# Altium project Teclado numerico.PrjPcb
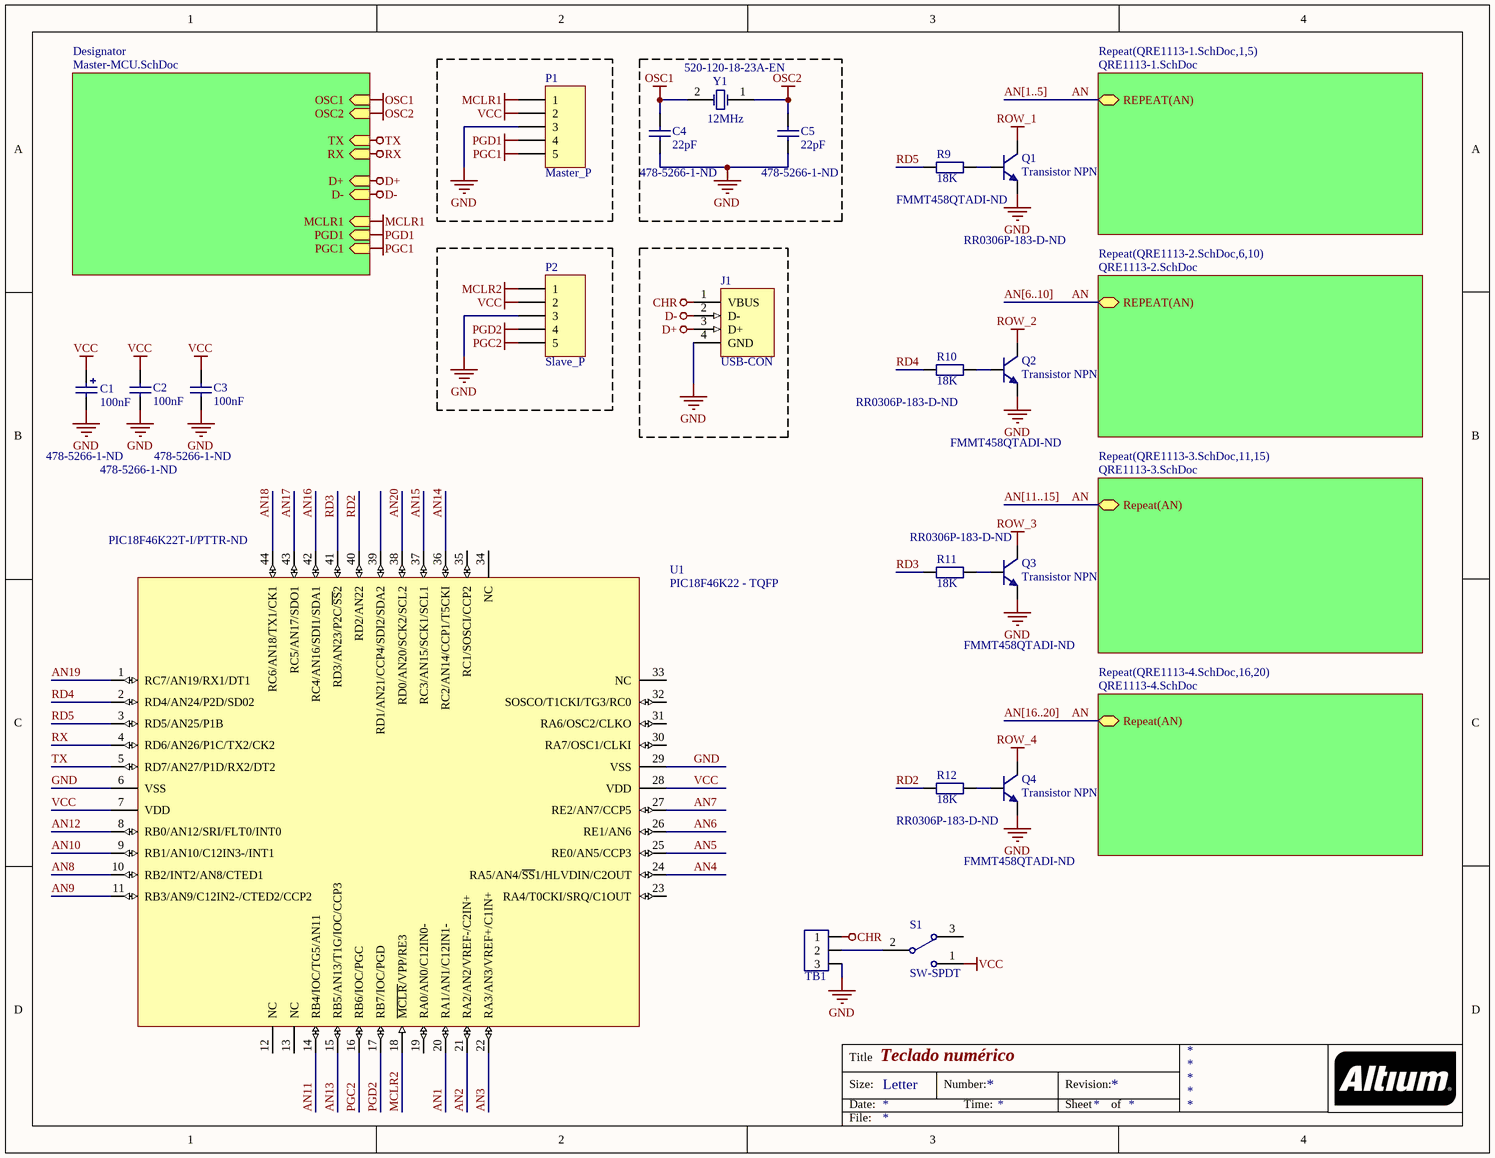
[diagram p0: Teclado numerico.SchDoc]
6 sheets, 108 parts. Net scope: hierarchical (ports join the sheet entries above them; power ports are global).
Board file: Teclado numerico.PcbDoc
Sheets:
  Teclado numerico.SchDoc
    Designator = Master-MCU.SchDoc
    QRE1113-1.SchDoc1 = QRE1113-1.SchDoc
    QRE1113-1.SchDoc2 = QRE1113-1.SchDoc
    QRE1113-1.SchDoc3 = QRE1113-1.SchDoc
    QRE1113-1.SchDoc4 = QRE1113-1.SchDoc
    QRE1113-1.SchDoc5 = QRE1113-1.SchDoc
    QRE1113-2.SchDoc6 = QRE1113-2.SchDoc
    QRE1113-2.SchDoc7 = QRE1113-2.SchDoc
    QRE1113-2.SchDoc8 = QRE1113-2.SchDoc
    QRE1113-2.SchDoc9 = QRE1113-2.SchDoc
    QRE1113-2.SchDoc10 = QRE1113-2.SchDoc
    QRE1113-3.SchDoc11 = QRE1113-3.SchDoc
    QRE1113-3.SchDoc12 = QRE1113-3.SchDoc
    QRE1113-3.SchDoc13 = QRE1113-3.SchDoc
    QRE1113-3.SchDoc14 = QRE1113-3.SchDoc
    QRE1113-3.SchDoc15 = QRE1113-3.SchDoc
    QRE1113-4.SchDoc16 = QRE1113-4.SchDoc
    QRE1113-4.SchDoc17 = QRE1113-4.SchDoc
    QRE1113-4.SchDoc18 = QRE1113-4.SchDoc
    QRE1113-4.SchDoc19 = QRE1113-4.SchDoc
    QRE1113-4.SchDoc20 = QRE1113-4.SchDoc

## Sheet Teclado numerico.SchDoc: Teclado numérico
size Letter

### Parts
C1  100nF  Supplier Part Number 1: 478-5266-1-ND  [C-0603]
C2  100nF  Supplier Part Number 1: 478-5266-1-ND  [C-0603]
C3  100nF  Supplier Part Number 1: 478-5266-1-ND  [C-0603]
C4  22pF  Supplier Part Number 1: 478-5266-1-ND  [C-0603]
C5  22pF  Supplier Part Number 1: 478-5266-1-ND  [C-0603]
J1  USB-CON  [USB-A]
P1  Master_P  [HDR1X5]
P2  Slave_P  [HDR1X5]
Q1  Transistor NPN  Supplier Part Number 1: FMMT458QTADI-ND  [SOT95P237X111-3M-JV]
Q2  Transistor NPN  Supplier Part Number 1: FMMT458QTADI-ND  [SOT95P237X111-3M-JV]
Q3  Transistor NPN  Supplier Part Number 1: FMMT458QTADI-ND  [SOT95P237X111-3M-JV]
Q4  Transistor NPN  Supplier Part Number 1: FMMT458QTADI-ND  [SOT95P237X111-3M-JV]
R9  18K  Supplier Part Number 1: RR0306P-183-D-ND  [R-0603]
R10  18K  Supplier Part Number 1: RR0306P-183-D-ND  [R-0603]
R11  18K  Supplier Part Number 1: RR0306P-183-D-ND  [R-0603]
R12  18K  Supplier Part Number 1: RR0306P-183-D-ND  [R-0603]
S1  SW-SPDT  [SPDT]
TB1  Terminal Block 3  [SPDT]  (value not drawn)
U1  PIC18F46K22 - TQFP  Supplier Part Number 3: PIC18F46K22T-I/PTTR-ND  [TQFP-44_JV]
Y1  12MHz  Supplier Part Number 1: 520-120-18-23A-EN  [ECX64A-jv]

### Sub-sheets
Designator = Master-MCU.SchDoc: OSC1 (in), OSC2 (in), TX (in), RX (in), D+ (in), D- (in), MCLR1 (in), PGD1 (in), PGC1 (in)
Repeat(QRE1113-1.SchDoc,1,5) = QRE1113-1.SchDoc: REPEAT(AN)
Repeat(QRE1113-2.SchDoc,6,10) = QRE1113-2.SchDoc: REPEAT(AN)
Repeat(QRE1113-3.SchDoc,11,15) = QRE1113-3.SchDoc: Repeat(AN)
Repeat(QRE1113-4.SchDoc,16,20) = QRE1113-4.SchDoc: Repeat(AN)

### Nets
CHR: J1.1(VBUS) TB1.1
D+: J1.3(D+) ; sheet Designator/D+
D-: J1.2(D-) ; sheet Designator/D-
GND: C1.2 C2.1 C3.1 C4.2 C5.2 J1.4(GND) P1.3 P2.3 Q1.1(E) Q2.1(E) Q3.1(E) Q4.1(E) TB1.3 U1.6(VSS) U1.29(VSS)
MCLR1: P1.1 ; sheet Designator/MCLR1
MCLR2: P2.1 U1.18(~{MCLR}/VPP/RE3)
OSC1: C4.1 Y1.2(OSC2) ; sheet Designator/OSC1
OSC2: C5.1 Y1.1(OSC1) ; sheet Designator/OSC2
PGC1: P1.5 ; sheet Designator/PGC1
PGC2: P2.5 U1.16(RB6/IOC/PGC)
PGD1: P1.4 ; sheet Designator/PGD1
PGD2: P2.4 U1.17(RB7/IOC/PGD)
ROW_1: Q1.3(C)
ROW_2: Q2.3(C)
ROW_3: Q3.3(C)
ROW_4: Q4.3(C)
RX: U1.4(RD6/AN26/P1C/TX2/CK2) ; sheet Designator/RX
TX: U1.5(RD7/AN27/P1D/RX2/DT2) ; sheet Designator/TX
VCC: C1.1 C2.2 C3.2 P1.2 P2.2 S1.1 U1.7(VDD) U1.28(VDD)
AN: sheet Repeat(QRE1113-1.SchDoc,1,5)/REPEAT(AN), sheet Repeat(QRE1113-2.SchDoc,6,10)/REPEAT(AN), sheet Repeat(QRE1113-3.SchDoc,11,15)/Repeat(AN), sheet Repeat(QRE1113-4.SchDoc,16,20)/Repeat(AN)
AN1: U1.20(RA1/AN1/C12IN1-)  [project net AN]
AN2: U1.21(RA2/AN2/VREF-/C2IN+)  [project net AN]
AN3: U1.22(RA3/AN3/VREF+/C1IN+)  [project net AN]
AN4: U1.24(RA5/AN4/~{SS}1/HLVDIN/C2OUT)  [project net AN]
AN5: U1.25(RE0/AN5/CCP3)  [project net AN]
AN6: U1.26(RE1/AN6)  [project net AN]
AN7: U1.27(RE2/AN7/CCP5)  [project net AN]
AN8: U1.10(RB2/INT2/AN8/CTED1)  [project net AN]
AN9: U1.11(RB3/AN9/C12IN2-/CTED2/CCP2)  [project net AN]
AN10: U1.9(RB1/AN10/C12IN3-/INT1)  [project net AN]
AN11: U1.14(RB4/IOC/TG5/AN11)  [project net AN]
AN12: U1.8(RB0/AN12/SRI/FLT0/INT0)  [project net AN]
AN13: U1.15(RB5/AN13/T1G/IOC/CCP3)  [project net AN]
AN14: U1.36(RC2/AN14/CCP1/T5CKI)  [project net AN]
AN15: U1.37(RC3/AN15/SCK1/SCL1)  [project net AN]
AN16: U1.42(RC4/AN16/SDI1/SDA1)  [project net AN]
AN17: U1.43(RC5/AN17/SDO1)  [project net AN]
AN18: U1.44(RC6/AN18/TX1/CK1)  [project net AN]
AN19: U1.1(RC7/AN19/RX1/DT1)  [project net AN]
AN20: U1.38(RD0/AN20/SCK2/SCL2)  [project net AN]
RD2: R12.1 U1.40(RD2/AN22)
RD3: R11.1 U1.41(RD3/AN23/P2C/~{SS}2)
RD4: R10.1 U1.2(RD4/AN24/P2D/SD02)
RD5: R9.1 U1.3(RD5/AN25/P1B)
NetQ1_2: Q1.2(B) R9.2
NetQ2_2: Q2.2(B) R10.2
NetQ3_2: Q3.2(B) R11.2
NetQ4_2: Q4.2(B) R12.2
NetS1_2: S1.2 TB1.2

Not connected (* = marked no-connect by the designer): S1 3; U1 12(NC) 13(NC) 19(RA0/AN0/C12IN0-) 23(RA4/T0CKI/SRQ/C1OUT) 30(RA7/OSC1/CLKI) 31(RA6/OSC2/CLKO) 32(SOSCO/T1CKI/TG3/RC0) 33(NC) 34(NC) 35(RC1/SOSCI/CCP2) 39(RD1/AN21/CCP4/SDI2/SDA2)

### Buses and harness runs
bus AN[1..5]
bus AN[6..10]
bus AN[11..15]
bus AN[16..20]

### Notes on the sheet
- Title
- Size:
- Date:
- Letter
- Number:
- Time:
- Revision:
- Sheet
- of
- File:

### Library data of the parts
C1 = Electrolytic Capacitor: Value: 100uF; Supplier 1: Digi-Key
C2-C5 = Capacitor 1: Capacitor; Value: 100pF; Supplier 1: Digi-Key
J1 = USB-CON: USB 1.1, Right Angle, SMT, A Type, Receptacle, 4 Position, White; ContactMaterial: Copper Alloy; ContactPlating: Gold over Palladium Nickel; PCB_Layout: Complies with manufacturer's recommendation.; DrillSize: Corresponds to nominal value.; PanelGround: Without; Published: 15-Jul-2004; DatasheetDocument: 11-Apr-2003; PackageDocument: 11-Apr-2003; PackageReference: 353576; Publisher: Altium Limited; HousingMaterial: Thermoplastic; ComponentLink1Description: Manufacturer Link; ComponentLink1URL: http://www.tycoelectronics.com/; ComponentLink2Description: Packaging Specification; ComponentLink2URL: http://ecommas.tycoelectronics.com/commerce/DocumentDelivery/DDEController?Action=showdoc&DocId=Customer+Drawing%7F353576%7FD%7Ftif%7FJapanese%7FJPN_CD_353576_D.tif
P1 P2 = Header 5: Header, 5-Pin; LatestRevisionDate: 17-Jul-2002; LatestRevisionNote: Re-released for DXP Platform.; Publisher: Altium Limited
Q1-Q4 = Transistor NPN: NPN General Purpose Amplifier; Published: 8-Jun-2000; LatestRevisionDate: 15-Jan-2003; LatestRevisionNote: PCB Footprint 'BCY-W3/D4.7' replaced; DatasheetVersion: 1997; PackageVersion: Sep-1998; PackageReference: TO-92A; Publisher: Altium Limited; Code_JEDEC: TO-92A; ComponentLink1Description: Manufacturer Link; ComponentLink1URL: http://www.fairchildsemi.com/; ComponentLink2Description: Datasheet; ComponentLink2URL: http://www.fairchildsemi.com/ds/2N%2F2N3904.pdf; Supplier 1: Digi-Key
R9-R12 = Resistor 1: Resistor; Value: 1K; Supplier 1: Digi-Key
S1 = SW-SPDT: SPDT Subminiature Toggle Switch, Right Angle Mounting, Vertical Actuation; Published: 24-Mar-1999; LatestRevisionDate: 17-Dec-2003; LatestRevisionNote: Schematic revised, PCB Footprint replaced.; DatasheetVersion: 05-Dec-2000; PackageReference: TL36WW15050; Publisher: Altium Limited; ComponentLink1Description: Manufacturer Link; ComponentLink1URL: http://www.apem.com
TB1 = Terminal Block 3: Terminal Block, 3 pins
U1 = PIC18F46K22 - TQFP: Flash Microcontroller with 10-Bit A/D and nanoWatt Technology, 32K Flash, 44-Pin QFN, Extended Temperature Range; Published: 2-Dec-2009; DatasheetVersion: revF, Sep-2009; PackageVersion: revBB, Aug-2009; PackageReference: QFN-ML44; Publisher: Altium Limited; PackageDescription: 44-Lead Plastic Quad Flat, No Lead Package (ML) - 8x8 mm Body [QFN]; Supplier 1: Digi-Key; Supplier Part Number 1: PIC18F46K20-E/ML-ND; Supplier 2: Farnell; Supplier Part Number 2: 1664863; Code_JEDEC: MO-220; Code_IPC: QFN65P800X800-44V2; ComponentLink1Description: Datasheet; ComponentLink1URL: http://ww1.microchip.com/downloads/en/DeviceDoc/41303F.pdf; ComponentLink2Description: Packaging Specification; ComponentLink2URL: http://www.microchip.com/stellent/groups/techpub_sg/documents/packagingspec/en012702.pdf; ComponentLink3Description: Microchip.com Home; ComponentLink3URL: http://www.microchip.com/; Supplier 3: Digi-Key
Y1 = XTAL: Crystal Oscillator; Published: 8-Jun-2000; LatestRevisionDate: 17-Jul-2002; LatestRevisionNote: Re-released for DXP Platform.; PackageReference: R38; Publisher: Altium Limited; Supplier 1: Mouser

## Sheet Master-MCU.SchDoc
size A
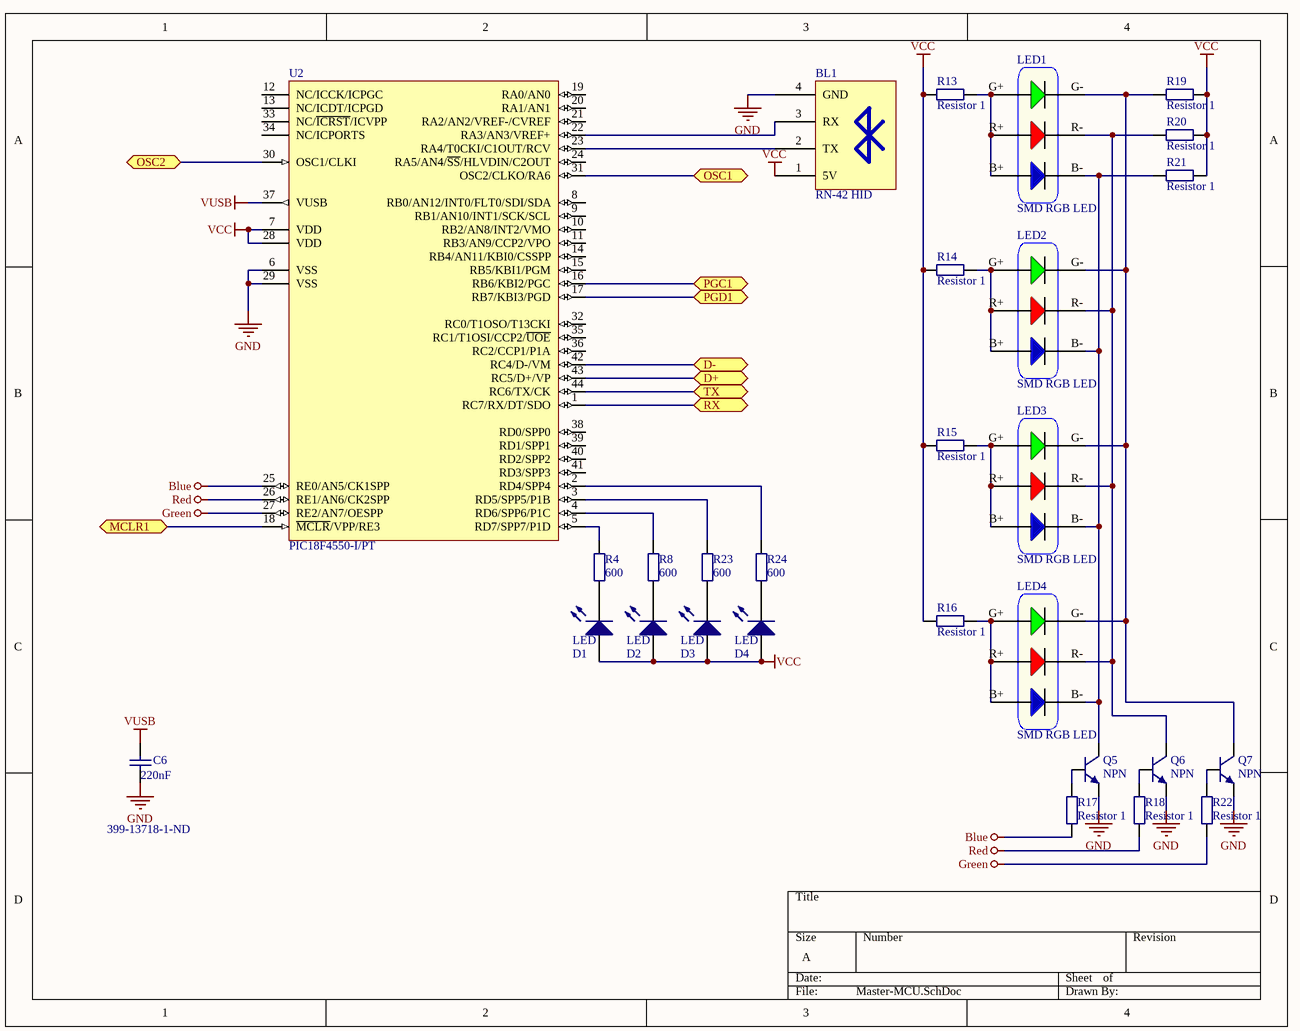
[diagram p1: Master-MCU.SchDoc]

### Parts
BL1  RN-42 HID  [Bluetooth module for PCB mounting]
C6  220nF  Supplier Part Number 1: 399-13718-1-ND  [C-0603]
D1  LED  [LED-SMD-R]
D2  LED  [LED-SMD-R]
D3  LED  [LED-SMD-R]
D4  LED  [LED-SMD-R]
LED1  SMD RGB LED  [SMD LED]
LED2  SMD RGB LED  [SMD LED]
LED3  SMD RGB LED  [SMD LED]
LED4  SMD RGB LED  [SMD LED]
Q5  NPN  [SOT95P237X111-3M-JV]
Q6  NPN  [SOT95P237X111-3M-JV]
Q7  NPN  [SOT95P237X111-3M-JV]
R4  600  [R-0603-3D]
R8  600  [R-0603-3D]
R13  Resistor 1  [R-0603-3D]
R14  Resistor 1  [R-0603-3D]
R15  Resistor 1  [R-0603-3D]
R16  Resistor 1  [R-0603-3D]
R17  Resistor 1  [R-0603-3D]
R18  Resistor 1  [R-0603-3D]
R19  Resistor 1  [R-0603-3D]
R20  Resistor 1  [R-0603-3D]
R21  Resistor 1  [R-0603-3D]
R22  Resistor 1  [R-0603-3D]
R23  600  [R-0603-3D]
R24  600  [R-0603-3D]
U2  PIC18F4550-I/PT  [TQFP-44_JV]

### Ports
D+, D-, MCLR1, OSC1, OSC2, PGC1, PGD1, RX, TX

### Nets
Blue: R17.1 U2.25(RE0/AN5/CK1SPP)
D+: U2.43(RC5/D+/VP) ; port D+
D-: U2.42(RC4/D-/VM) ; port D-
GND: BL1.4(GND) C6.1 Q5.1(E) Q6.1(E) Q7.1(E) U2.6(VSS) U2.29(VSS)
Green: R22.1 U2.27(RE2/AN7/OESPP)
MCLR1: U2.18(~{MCLR}/VPP/RE3) ; port MCLR1
OSC1: U2.31(OSC2/CLKO/RA6) ; port OSC1
OSC2: U2.30(OSC1/CLKI) ; port OSC2
PGC1: U2.16(RB6/KBI2/PGC) ; port PGC1
PGD1: U2.17(RB7/KBI3/PGD) ; port PGD1
Red: R18.1 U2.26(RE1/AN6/CK2SPP)
RX: U2.1(RC7/RX/DT/SDO) ; port RX
TX: U2.44(RC6/TX/CK) ; port TX
VCC: BL1.1(5V) D1.1(A) D2.1(A) D3.1(A) D4.1(A) R13.1 R14.1 R15.1 R16.1 R19.1 R20.1 R21.1 U2.7(VDD) U2.28(VDD)
VUSB: C6.2 U2.37(VUSB)
NetBL1_2: BL1.2(TX) U2.23(RA4/T0CKI/C1OUT/RCV)
NetBL1_3: BL1.3(RX) U2.22(RA3/AN3/VREF+)
NetD1_2: D1.2(K) R4.2
NetD2_2: D2.2(K) R8.2
NetD3_2: D3.2(K) R23.2
NetD4_2: D4.2(K) R24.2
NetLED1_B+: LED1.B+ LED1.G+ LED1.R+ R13.2
NetLED1_B-: LED1.B- LED2.B- LED3.B- LED4.B- Q5.3(C) R21.2
NetLED1_G-: LED1.G- LED2.G- LED3.G- LED4.G- Q7.3(C) R19.2
NetLED1_R-: LED1.R- LED2.R- LED3.R- LED4.R- Q6.3(C) R20.2
NetLED2_B+: LED2.B+ LED2.G+ LED2.R+ R14.2
NetLED3_B+: LED3.B+ LED3.G+ LED3.R+ R15.2
NetLED4_B+: LED4.B+ LED4.G+ LED4.R+ R16.2
NetQ5_2: Q5.2(B) R17.2
NetQ6_2: Q6.2(B) R18.2
NetQ7_2: Q7.2(B) R22.2
NetR4_1: R4.1 U2.5(RD7/SPP7/P1D)
NetR8_1: R8.1 U2.4(RD6/SPP6/P1C)
NetR23_1: R23.1 U2.3(RD5/SPP5/P1B)
NetR24_1: R24.1 U2.2(RD4/SPP4)

Not connected (* = marked no-connect by the designer): U2 8(RB0/AN12/INT0/FLT0/SDI/SDA) 9(RB1/AN10/INT1/SCK/SCL) 10(RB2/AN8/INT2/VMO) 11(RB3/AN9/CCP2/VPO) 12(NC/ICCK/ICPGC) 13(NC/ICDT/ICPGD) 14(RB4/AN11/KBI0/CSSPP) 15(RB5/KBI1/PGM) 19(RA0/AN0) 20(RA1/AN1) 21(RA2/AN2/VREF-/CVREF) 24(RA5/AN4/~{SS}/HLVDIN/C2OUT) 32(RC0/T1OSO/T13CKI) 33(NC/~{ICRST}/ICVPP) 34(NC/ICPORTS) 35(RC1/T1OSI/CCP2/~{UOE}) 36(RC2/CCP1/P1A) 38(RD0/SPP0) 39(RD1/SPP1) 40(RD2/SPP2) 41(RD3/SPP3)

### Library data of the parts
BL1 = Bluetooth module for PCB mounting
C6 = Capacitor 1: Capacitor; Value: 100pF; Supplier 1: Digi-Key
D1-D4 = LED: Typical LED; Published: 8-Jun-2000; LatestRevisionDate: 17-Jul-2002; LatestRevisionNote: Re-released for DXP Platform.; PackageVersion: Feb-2002; PackageReference: 3.2X1.6X1.1; Publisher: Altium Limited
LED1-LED4 = LED: https://www.tweaking4all.com/wp-content/uploads/2014/01/5050LED.pdf
Q5-Q7 = Transistor NPN: NPN General Purpose Amplifier; Published: 8-Jun-2000; LatestRevisionDate: 15-Jan-2003; LatestRevisionNote: PCB Footprint 'BCY-W3/D4.7' replaced; DatasheetVersion: 1997; PackageVersion: Sep-1998; PackageReference: TO-92A; Publisher: Altium Limited; Code_JEDEC: TO-92A; ComponentLink1Description: Manufacturer Link; ComponentLink1URL: http://www.fairchildsemi.com/; ComponentLink2Description: Datasheet; ComponentLink2URL: http://www.fairchildsemi.com/ds/2N%2F2N3904.pdf
R4 R8 R13-R24 = Resistor 1: Resistor; Value: 1K
U2 = PIC18F4550-I/PT: High Performance, Enhanced Flash, USB Microcontroller with nanoWatt Technology, 32K Flash, 44-Pin TQFP, Industrial Temperature Range; Published: 29-Jan-2009; LatestRevisionDate: 02-Dec-2009; LatestRevisionNote: Updated to datasheet revision E, Aug-2008; DatasheetVersion: revE, Aug-2008; PackageVersion: revBB, Aug-2009; PackageReference: TQFP-PT44; Publisher: Altium Limited; PackageDescription: 44-Lead Plastic Thin Quad Flatpack (PT) - 10x10x1mm Body, 2.00mm [TQFP]; Supplier 1: Digi-Key; Supplier Part Number 1: PIC18F4550-I/PT-ND; Supplier 2: Farnell; Supplier Part Number 2: 9321365; Supplier 3: Farnell; Supplier Part Number 3: 1528447; Code_JEDEC: MS-026; ComponentLink1Description: Datasheet; ComponentLink1URL: http://ww1.microchip.com/downloads/en/DeviceDoc/39632e.pdf; ComponentLink2Description: Packaging Specification; ComponentLink2URL: http://www.microchip.com/stellent/groups/techpub_sg/documents/packagingspec/en012702.pdf; ComponentLink3Description: Microchip.com Home; ComponentLink3URL: http://www.microchip.com/

## Sheet QRE1113-1.SchDoc
size A
Used 5 times, as channels QRE1113-1.SchDoc1, QRE1113-1.SchDoc2, QRE1113-1.SchDoc3, QRE1113-1.SchDoc4, QRE1113-1.SchDoc5. Parts and nets are listed once, with the designators drawn on the sheet.
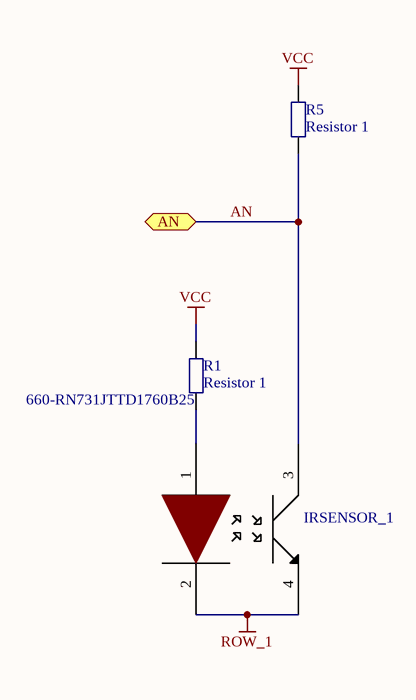
[diagram p2: QRE1113-1.SchDoc]

### Parts
IRSENSOR_1  QRE1113GR  [QRE1113GR]  (value not drawn)
R1  Resistor 1  Supplier Part Number 2: 660-RN731JTTD1760B25  [R-0603]
R5  Resistor 1  [R-0603]

### Ports
AN

### Nets
ROW_1: IRSENSOR_1.2 IRSENSOR_1.4
VCC: R1.1 R5.1
AN: IRSENSOR_1.3 R5.2 ; port AN
NetIRSENSOR_1_1: IRSENSOR_1.1 R1.2

### Channels
QRE1113-1.SchDoc1: designators end in _QRE1113-1.SchDoc1; ports AN=AN
QRE1113-1.SchDoc2: designators end in _QRE1113-1.SchDoc2; ports AN=AN
QRE1113-1.SchDoc3: designators end in _QRE1113-1.SchDoc3; ports AN=AN
QRE1113-1.SchDoc4: designators end in _QRE1113-1.SchDoc4; ports AN=AN
QRE1113-1.SchDoc5: designators end in _QRE1113-1.SchDoc5; ports AN=AN

### Library data of the parts
R1 R5 = Resistor 1: Resistor; Value: 1K
  R1: Supplier 1: Arrow; Supplier 2: Mouser
  R5: Supplier 1: Newark; Supplier Part Number 1: 68Y8139

## Sheet QRE1113-2.SchDoc
size A
Used 5 times, as channels QRE1113-2.SchDoc6, QRE1113-2.SchDoc7, QRE1113-2.SchDoc8, QRE1113-2.SchDoc9, QRE1113-2.SchDoc10. Parts and nets are listed once, with the designators drawn on the sheet.
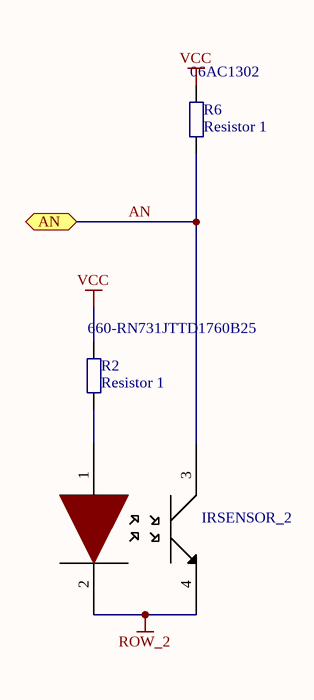
[diagram p3: QRE1113-2.SchDoc]

### Parts
IRSENSOR_2  QRE1113GR  [QRE1113GR]  (value not drawn)
R2  Resistor 1  Supplier Part Number 1: 660-RN731JTTD1760B25  [R-0603]
R6  Resistor 1  Supplier Part Number 1: 06AC1302  [R-0603]

### Ports
AN

### Nets
ROW_2: IRSENSOR_2.2 IRSENSOR_2.4
VCC: R2.2 R6.1
AN: IRSENSOR_2.3 R6.2 ; port AN
NetIRSENSOR_2_1: IRSENSOR_2.1 R2.1

### Channels
QRE1113-2.SchDoc6: designators end in _QRE1113-2.SchDoc6; ports AN=AN
QRE1113-2.SchDoc7: designators end in _QRE1113-2.SchDoc7; ports AN=AN
QRE1113-2.SchDoc8: designators end in _QRE1113-2.SchDoc8; ports AN=AN
QRE1113-2.SchDoc9: designators end in _QRE1113-2.SchDoc9; ports AN=AN
QRE1113-2.SchDoc10: designators end in _QRE1113-2.SchDoc10; ports AN=AN

### Library data of the parts
R2 R6 = Resistor 1: Resistor; Value: 1K
  R2: Supplier 1: Mouser
  R6: Supplier 1: Newark

## Sheet QRE1113-3.SchDoc
size A
Used 5 times, as channels QRE1113-3.SchDoc11, QRE1113-3.SchDoc12, QRE1113-3.SchDoc13, QRE1113-3.SchDoc14, QRE1113-3.SchDoc15. Parts and nets are listed once, with the designators drawn on the sheet.
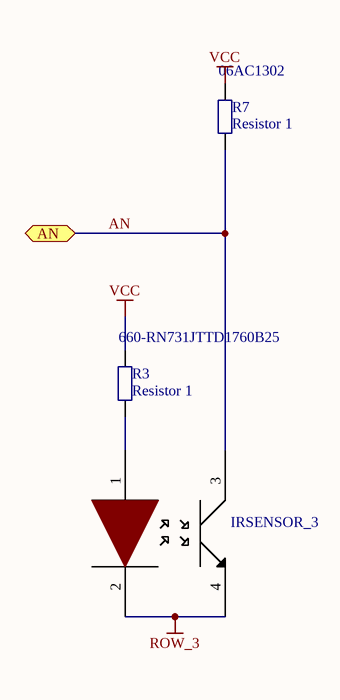
[diagram p4: QRE1113-3.SchDoc]

### Parts
IRSENSOR_3  QRE1113GR  [QRE1113GR]  (value not drawn)
R3  Resistor 1  Supplier Part Number 1: 660-RN731JTTD1760B25  [R-0603]
R7  Resistor 1  Supplier Part Number 1: 06AC1302  [R-0603]

### Ports
AN

### Nets
ROW_3: IRSENSOR_3.2 IRSENSOR_3.4
VCC: R3.2 R7.1
AN: IRSENSOR_3.3 R7.2 ; port AN
NetIRSENSOR_3_1: IRSENSOR_3.1 R3.1

### Channels
QRE1113-3.SchDoc11: designators end in _QRE1113-3.SchDoc11; ports AN=AN
QRE1113-3.SchDoc12: designators end in _QRE1113-3.SchDoc12; ports AN=AN
QRE1113-3.SchDoc13: designators end in _QRE1113-3.SchDoc13; ports AN=AN
QRE1113-3.SchDoc14: designators end in _QRE1113-3.SchDoc14; ports AN=AN
QRE1113-3.SchDoc15: designators end in _QRE1113-3.SchDoc15; ports AN=AN

### Library data of the parts
R3 R7 = Resistor 1: Resistor; Value: 1K
  R3: Supplier 1: Mouser
  R7: Supplier 1: Newark

## Sheet QRE1113-4.SchDoc
size A
Used 5 times, as channels QRE1113-4.SchDoc16, QRE1113-4.SchDoc17, QRE1113-4.SchDoc18, QRE1113-4.SchDoc19, QRE1113-4.SchDoc20. Parts and nets are listed once, with the designators drawn on the sheet.
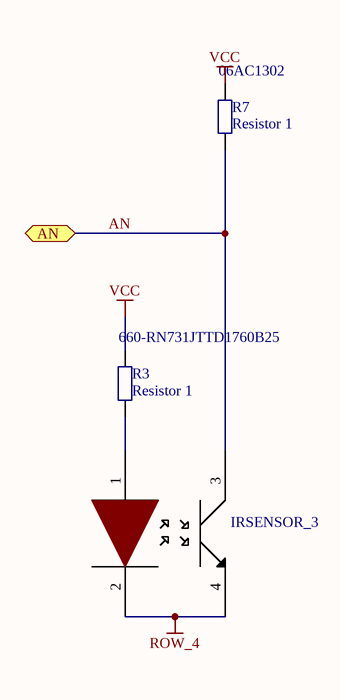
[diagram p5: QRE1113-4.SchDoc]

### Parts
IRSENSOR_3  QRE1113GR  [QRE1113GR]  (value not drawn)
R3  Resistor 1  Supplier Part Number 1: 660-RN731JTTD1760B25  [R-0603]
R7  Resistor 1  Supplier Part Number 1: 06AC1302  [R-0603]

### Ports
AN

### Nets
ROW_4: IRSENSOR_3.2 IRSENSOR_3.4
VCC: R3.2 R7.1
AN: IRSENSOR_3.3 R7.2 ; port AN
NetIRSENSOR_3_1: IRSENSOR_3.1 R3.1

### Channels
QRE1113-4.SchDoc16: designators end in _QRE1113-4.SchDoc16; ports AN=AN
QRE1113-4.SchDoc17: designators end in _QRE1113-4.SchDoc17; ports AN=AN
QRE1113-4.SchDoc18: designators end in _QRE1113-4.SchDoc18; ports AN=AN
QRE1113-4.SchDoc19: designators end in _QRE1113-4.SchDoc19; ports AN=AN
QRE1113-4.SchDoc20: designators end in _QRE1113-4.SchDoc20; ports AN=AN

### Library data of the parts
R3 R7 = Resistor 1: Resistor; Value: 1K
  R3: Supplier 1: Mouser
  R7: Supplier 1: Newark

## Nets that join several sheets
D+: Teclado numerico (J1.3), Master-MCU (U2.43)
D-: Teclado numerico (J1.2), Master-MCU (U2.42)
GND: Teclado numerico (15 pins), Master-MCU (7 pins)
MCLR1: Teclado numerico (P1.1), Master-MCU (U2.18)
OSC1: Teclado numerico (C4.1 Y1.2), Master-MCU (U2.31)
OSC2: Teclado numerico (C5.1 Y1.1), Master-MCU (U2.30)
PGC1: Teclado numerico (P1.5), Master-MCU (U2.16)
PGD1: Teclado numerico (P1.4), Master-MCU (U2.17)
ROW_1: Teclado numerico (Q1.3), QRE1113-1.SchDoc1 (IRSENSOR_1_QRE1113-1.SchDoc1.2 IRSENSOR_1_QRE1113-1.SchDoc1.4), QRE1113-1.SchDoc2 (IRSENSOR_1_QRE1113-1.SchDoc2.2 IRSENSOR_1_QRE1113-1.SchDoc2.4), QRE1113-1.SchDoc3 (IRSENSOR_1_QRE1113-1.SchDoc3.2 IRSENSOR_1_QRE1113-1.SchDoc3.4), QRE1113-1.SchDoc4 (IRSENSOR_1_QRE1113-1.SchDoc4.2 IRSENSOR_1_QRE1113-1.SchDoc4.4), QRE1113-1.SchDoc5 (IRSENSOR_1_QRE1113-1.SchDoc5.2 IRSENSOR_1_QRE1113-1.SchDoc5.4)
ROW_2: Teclado numerico (Q2.3), QRE1113-2.SchDoc6 (IRSENSOR_2_QRE1113-2.SchDoc6.2 IRSENSOR_2_QRE1113-2.SchDoc6.4), QRE1113-2.SchDoc7 (IRSENSOR_2_QRE1113-2.SchDoc7.2 IRSENSOR_2_QRE1113-2.SchDoc7.4), QRE1113-2.SchDoc8 (IRSENSOR_2_QRE1113-2.SchDoc8.2 IRSENSOR_2_QRE1113-2.SchDoc8.4), QRE1113-2.SchDoc9 (IRSENSOR_2_QRE1113-2.SchDoc9.2 IRSENSOR_2_QRE1113-2.SchDoc9.4), QRE1113-2.SchDoc10 (IRSENSOR_2_QRE1113-2.SchDoc10.2 IRSENSOR_2_QRE1113-2.SchDoc10.4)
ROW_3: Teclado numerico (Q3.3), QRE1113-3.SchDoc11 (IRSENSOR_3_QRE1113-3.SchDoc11.2 IRSENSOR_3_QRE1113-3.SchDoc11.4), QRE1113-3.SchDoc12 (IRSENSOR_3_QRE1113-3.SchDoc12.2 IRSENSOR_3_QRE1113-3.SchDoc12.4), QRE1113-3.SchDoc13 (IRSENSOR_3_QRE1113-3.SchDoc13.2 IRSENSOR_3_QRE1113-3.SchDoc13.4), QRE1113-3.SchDoc14 (IRSENSOR_3_QRE1113-3.SchDoc14.2 IRSENSOR_3_QRE1113-3.SchDoc14.4), QRE1113-3.SchDoc15 (IRSENSOR_3_QRE1113-3.SchDoc15.2 IRSENSOR_3_QRE1113-3.SchDoc15.4)
ROW_4: Teclado numerico (Q4.3), QRE1113-4.SchDoc16 (IRSENSOR_3_QRE1113-4.SchDoc16.2 IRSENSOR_3_QRE1113-4.SchDoc16.4), QRE1113-4.SchDoc17 (IRSENSOR_3_QRE1113-4.SchDoc17.2 IRSENSOR_3_QRE1113-4.SchDoc17.4), QRE1113-4.SchDoc18 (IRSENSOR_3_QRE1113-4.SchDoc18.2 IRSENSOR_3_QRE1113-4.SchDoc18.4), QRE1113-4.SchDoc19 (IRSENSOR_3_QRE1113-4.SchDoc19.2 IRSENSOR_3_QRE1113-4.SchDoc19.4), QRE1113-4.SchDoc20 (IRSENSOR_3_QRE1113-4.SchDoc20.2 IRSENSOR_3_QRE1113-4.SchDoc20.4)
RX: Teclado numerico (U1.4), Master-MCU (U2.1)
TX: Teclado numerico (U1.5), Master-MCU (U2.44)
VCC: Teclado numerico (8 pins), Master-MCU (14 pins), QRE1113-1.SchDoc1 (R1_QRE1113-1.SchDoc1.1 R5_QRE1113-1.SchDoc1.1), QRE1113-1.SchDoc2 (R1_QRE1113-1.SchDoc2.1 R5_QRE1113-1.SchDoc2.1), QRE1113-1.SchDoc3 (R1_QRE1113-1.SchDoc3.1 R5_QRE1113-1.SchDoc3.1), QRE1113-1.SchDoc4 (R1_QRE1113-1.SchDoc4.1 R5_QRE1113-1.SchDoc4.1), QRE1113-1.SchDoc5 (R1_QRE1113-1.SchDoc5.1 R5_QRE1113-1.SchDoc5.1), QRE1113-2.SchDoc6 (R2_QRE1113-2.SchDoc6.2 R6_QRE1113-2.SchDoc6.1), QRE1113-2.SchDoc7 (R2_QRE1113-2.SchDoc7.2 R6_QRE1113-2.SchDoc7.1), QRE1113-2.SchDoc8 (R2_QRE1113-2.SchDoc8.2 R6_QRE1113-2.SchDoc8.1), QRE1113-2.SchDoc9 (R2_QRE1113-2.SchDoc9.2 R6_QRE1113-2.SchDoc9.1), QRE1113-2.SchDoc10 (R2_QRE1113-2.SchDoc10.2 R6_QRE1113-2.SchDoc10.1), QRE1113-3.SchDoc11 (R3_QRE1113-3.SchDoc11.2 R7_QRE1113-3.SchDoc11.1), QRE1113-3.SchDoc12 (R3_QRE1113-3.SchDoc12.2 R7_QRE1113-3.SchDoc12.1), QRE1113-3.SchDoc13 (R3_QRE1113-3.SchDoc13.2 R7_QRE1113-3.SchDoc13.1), QRE1113-3.SchDoc14 (R3_QRE1113-3.SchDoc14.2 R7_QRE1113-3.SchDoc14.1), QRE1113-3.SchDoc15 (R3_QRE1113-3.SchDoc15.2 R7_QRE1113-3.SchDoc15.1), QRE1113-4.SchDoc16 (R3_QRE1113-4.SchDoc16.2 R7_QRE1113-4.SchDoc16.1), QRE1113-4.SchDoc17 (R3_QRE1113-4.SchDoc17.2 R7_QRE1113-4.SchDoc17.1), QRE1113-4.SchDoc18 (R3_QRE1113-4.SchDoc18.2 R7_QRE1113-4.SchDoc18.1), QRE1113-4.SchDoc19 (R3_QRE1113-4.SchDoc19.2 R7_QRE1113-4.SchDoc19.1), QRE1113-4.SchDoc20 (R3_QRE1113-4.SchDoc20.2 R7_QRE1113-4.SchDoc20.1)
AN: Teclado numerico (U1.1), QRE1113-4.SchDoc19 (IRSENSOR_3_QRE1113-4.SchDoc19.3 R7_QRE1113-4.SchDoc19.2)
AN: Teclado numerico (U1.8), QRE1113-3.SchDoc12 (IRSENSOR_3_QRE1113-3.SchDoc12.3 R7_QRE1113-3.SchDoc12.2)
AN: Teclado numerico (U1.9), QRE1113-2.SchDoc10 (IRSENSOR_2_QRE1113-2.SchDoc10.3 R6_QRE1113-2.SchDoc10.2)
AN: Teclado numerico (U1.10), QRE1113-2.SchDoc8 (IRSENSOR_2_QRE1113-2.SchDoc8.3 R6_QRE1113-2.SchDoc8.2)
AN: Teclado numerico (U1.11), QRE1113-2.SchDoc9 (IRSENSOR_2_QRE1113-2.SchDoc9.3 R6_QRE1113-2.SchDoc9.2)
AN: Teclado numerico (U1.14), QRE1113-3.SchDoc11 (IRSENSOR_3_QRE1113-3.SchDoc11.3 R7_QRE1113-3.SchDoc11.2)
AN: Teclado numerico (U1.15), QRE1113-3.SchDoc13 (IRSENSOR_3_QRE1113-3.SchDoc13.3 R7_QRE1113-3.SchDoc13.2)
AN: Teclado numerico (U1.20), QRE1113-1.SchDoc1 (IRSENSOR_1_QRE1113-1.SchDoc1.3 R5_QRE1113-1.SchDoc1.2)
AN: Teclado numerico (U1.21), QRE1113-1.SchDoc2 (IRSENSOR_1_QRE1113-1.SchDoc2.3 R5_QRE1113-1.SchDoc2.2)
AN: Teclado numerico (U1.22), QRE1113-1.SchDoc3 (IRSENSOR_1_QRE1113-1.SchDoc3.3 R5_QRE1113-1.SchDoc3.2)
AN: Teclado numerico (U1.24), QRE1113-1.SchDoc4 (IRSENSOR_1_QRE1113-1.SchDoc4.3 R5_QRE1113-1.SchDoc4.2)
AN: Teclado numerico (U1.25), QRE1113-1.SchDoc5 (IRSENSOR_1_QRE1113-1.SchDoc5.3 R5_QRE1113-1.SchDoc5.2)
AN: Teclado numerico (U1.26), QRE1113-2.SchDoc6 (IRSENSOR_2_QRE1113-2.SchDoc6.3 R6_QRE1113-2.SchDoc6.2)
AN: Teclado numerico (U1.27), QRE1113-2.SchDoc7 (IRSENSOR_2_QRE1113-2.SchDoc7.3 R6_QRE1113-2.SchDoc7.2)
AN: Teclado numerico (U1.36), QRE1113-3.SchDoc14 (IRSENSOR_3_QRE1113-3.SchDoc14.3 R7_QRE1113-3.SchDoc14.2)
AN: Teclado numerico (U1.37), QRE1113-3.SchDoc15 (IRSENSOR_3_QRE1113-3.SchDoc15.3 R7_QRE1113-3.SchDoc15.2)
AN: Teclado numerico (U1.38), QRE1113-4.SchDoc20 (IRSENSOR_3_QRE1113-4.SchDoc20.3 R7_QRE1113-4.SchDoc20.2)
AN: Teclado numerico (U1.42), QRE1113-4.SchDoc16 (IRSENSOR_3_QRE1113-4.SchDoc16.3 R7_QRE1113-4.SchDoc16.2)
AN: Teclado numerico (U1.43), QRE1113-4.SchDoc17 (IRSENSOR_3_QRE1113-4.SchDoc17.3 R7_QRE1113-4.SchDoc17.2)
AN: Teclado numerico (U1.44), QRE1113-4.SchDoc18 (IRSENSOR_3_QRE1113-4.SchDoc18.3 R7_QRE1113-4.SchDoc18.2)